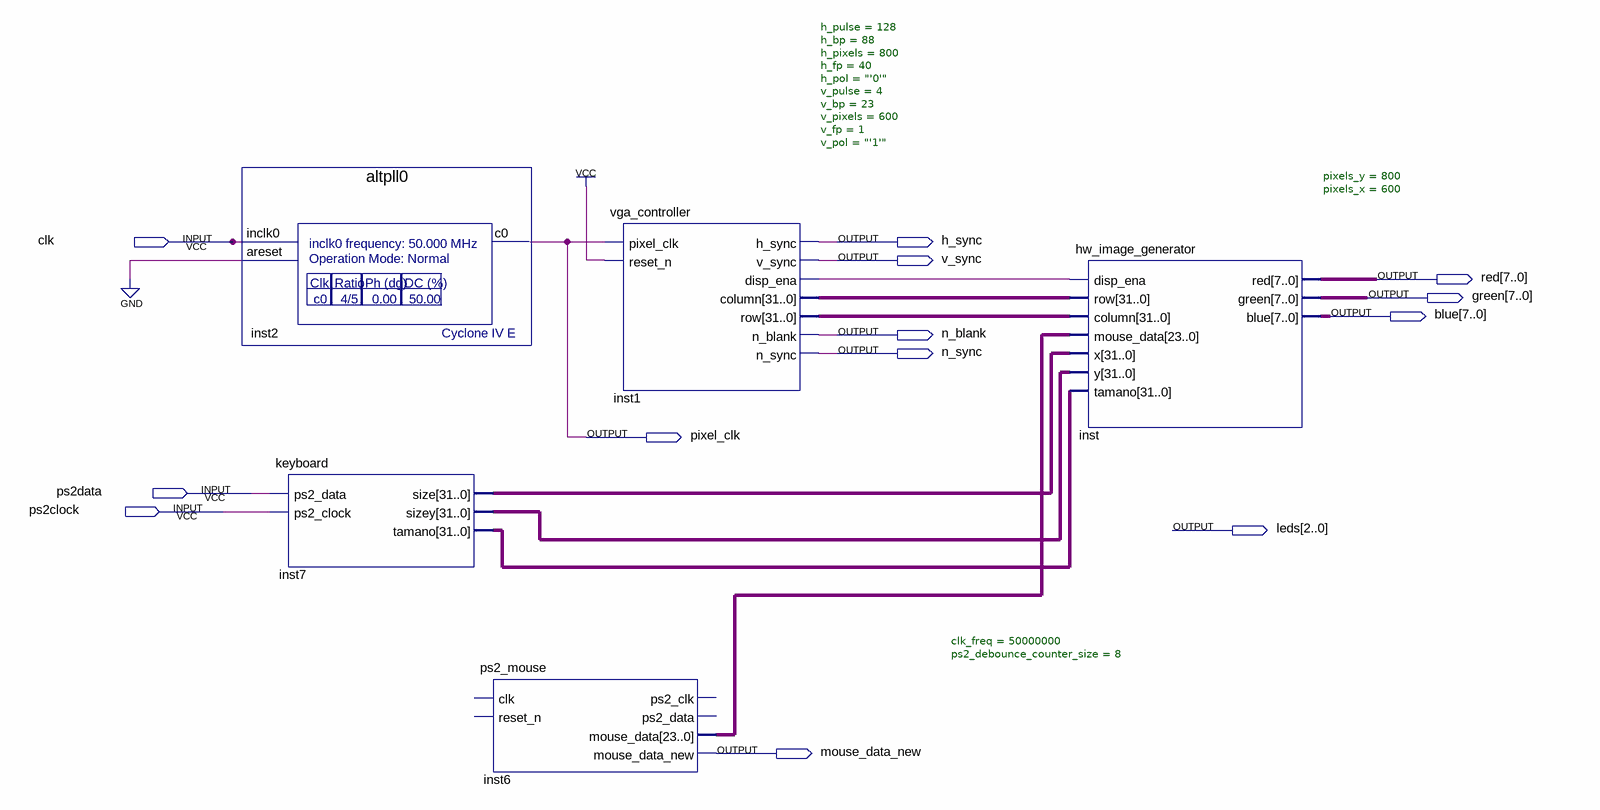
[diagram p0: schematic sheet]
// Quartus schematic vga_with_hw_test_image.bdf as structural Verilog: 5 symbols, 13 pins
module vga_with_hw_test_image (
  input  clk,
  input  ps2data,
  input  ps2clock,
  output h_sync,
  output v_sync,
  output [7:0] red,
  output [7:0] green,
  output [7:0] blue,
  output n_blank,
  output n_sync,
  output pixel_clk,
  output [2:0] leds,
  output mouse_data_new
);

  wire inst1_disp_ena;
  wire [23:0] inst6_mouse_data;
  wire [31:0] inst1_column, inst1_row, inst7_size, inst7_sizey, inst7_tamano;

  altpll0 inst2 (.inclk0(clk), .areset(1'b0), .c0(pixel_clk));
  keyboard inst7 (
    .ps2_data(ps2data), .ps2_clock(ps2clock), .size(inst7_size), .sizey(inst7_sizey), .tamano(inst7_tamano));
  ps2_mouse #(.clk_freq(50000000), .ps2_debounce_counter_size(8)) inst6 (
    .mouse_data(inst6_mouse_data), .mouse_data_new(mouse_data_new));  // open: clk, reset_n, ps2_clk, ps2_data
  vga_controller #(.h_pulse(128), .h_bp(88), .h_pixels(800), .h_fp(40), .h_pol("'0'"), .v_pulse(4), .v_bp(23), .v_pixels(600), .v_fp(1), .v_pol("'1'")) inst1 (
    .pixel_clk(pixel_clk), .reset_n(1'b1), .h_sync(h_sync), .v_sync(v_sync), .disp_ena(inst1_disp_ena),
    .column(inst1_column), .row(inst1_row), .n_blank(n_blank), .n_sync(n_sync));
  hw_image_generator #(.pixels_y(800), .pixels_x(600)) inst (
    .disp_ena(inst1_disp_ena), .row(inst1_column), .column(inst1_row), .mouse_data(inst6_mouse_data),
    .x(inst7_size), .y(inst7_sizey), .tamano(inst7_tamano), .red(red), .green(green), .blue(blue));
endmodule
